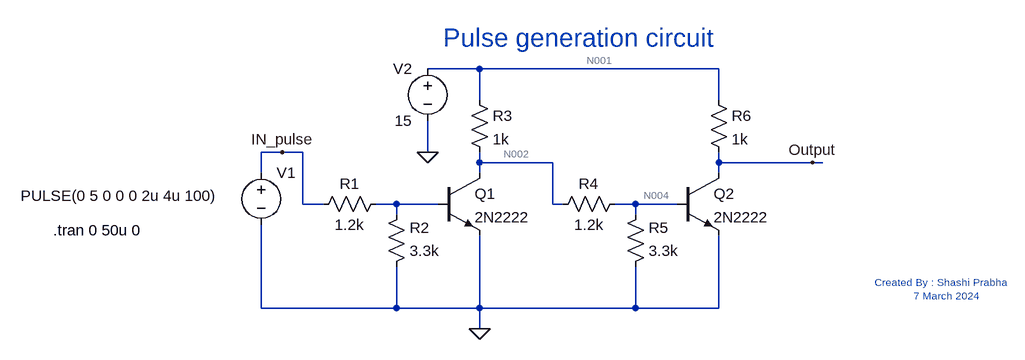
[diagram p0: schematic Pulse generation circuit.asc]
Pulse generation circuit.asc, the LTspice schematic file:
Version 4
SHEET 1 1060 680
WIRE 240 -32 160 -32
WIRE 608 -32 240 -32
WIRE 240 16 240 -32
WIRE 608 16 608 -32
WIRE -64 96 -96 96
WIRE -32 96 -64 96
WIRE 160 96 160 48
WIRE 240 112 240 96
WIRE 352 112 240 112
WIRE 608 112 608 96
WIRE 752 112 608 112
WIRE 768 112 752 112
WIRE -96 128 -96 96
WIRE 240 128 240 112
WIRE 608 128 608 112
WIRE -32 176 -32 96
WIRE 0 176 -32 176
WIRE 112 176 80 176
WIRE 176 176 112 176
WIRE 352 176 352 112
WIRE 368 176 352 176
WIRE 480 176 448 176
WIRE 544 176 480 176
WIRE 112 192 112 176
WIRE 480 192 480 176
WIRE -96 336 -96 208
WIRE 112 336 112 272
WIRE 112 336 -96 336
WIRE 240 336 240 224
WIRE 240 336 112 336
WIRE 480 336 480 272
WIRE 480 336 240 336
WIRE 608 336 608 224
WIRE 608 336 480 336
WIRE 240 368 240 336
FLAG 752 112 Output
FLAG -64 96 IN_pulse
FLAG 240 368 0
FLAG 160 96 0
SYMBOL res 96 160 R90
WINDOW 0 0 56 VBottom 2
WINDOW 3 32 56 VTop 2
SYMATTR InstName R1
SYMATTR Value 1.2k
SYMBOL res 96 288 M180
WINDOW 0 36 76 Left 2
WINDOW 3 36 40 Left 2
SYMATTR InstName R2
SYMATTR Value 3.3k
SYMBOL npn 176 128 R0
SYMATTR InstName Q1
SYMATTR Value 2N2222
SYMBOL res 224 0 R0
SYMATTR InstName R3
SYMATTR Value 1k
SYMBOL res 464 160 R90
WINDOW 0 0 56 VBottom 2
WINDOW 3 32 56 VTop 2
SYMATTR InstName R4
SYMATTR Value 1.2k
SYMBOL res 464 288 M180
WINDOW 0 36 76 Left 2
WINDOW 3 36 40 Left 2
SYMATTR InstName R5
SYMATTR Value 3.3k
SYMBOL npn 544 128 R0
SYMATTR InstName Q2
SYMATTR Value 2N2222
SYMBOL res 592 0 R0
SYMATTR InstName R6
SYMATTR Value 1k
SYMBOL voltage -96 112 R0
WINDOW 3 -370 51 Left 2
WINDOW 123 0 0 Left 0
WINDOW 39 0 0 Left 0
SYMATTR InstName V1
SYMATTR Value PULSE(0 5 0 0 0 2u 4u 100)
SYMBOL voltage 160 -48 M0
WINDOW 123 0 0 Left 0
WINDOW 39 0 0 Left 0
SYMATTR InstName V2
SYMATTR Value 15
TEXT -416 216 Left 2 !.tran 0 50u 0
TEXT 184 -80 Left 4 ;Pulse generation circuit
TEXT 848 296 Left 1 ;Created By : Shashi Prabha\n             7 March 2024

The netlist it stands for:
* Pulse generation circuit.asc
R1 N003 IN_pulse 1.2k
R2 0 N003 3.3k
Q1 N002 N003 0 0 2N2222
R3 N001 N002 1k
R4 N004 N002 1.2k
R5 0 N004 3.3k
Q2 Output N004 0 0 2N2222
R6 N001 Output 1k
V1 IN_pulse 0 PULSE(0 5 0 0 0 2u 4u 100)
V2 N001 0 15
.model NPN NPN
.model PNP PNP
.lib standard.bjt
.tran 0 50u 0
* Pulse generation circuit
* Created By : Shashi Prabha
*              7 March 2024
.backanno
.end

* Results of the author's LTspice run, read from the files saved beside the schematic
* Operating Point, zero values left out:
*   V(n002) = 8.554 V
*   V(n001) = 15 V
*   V(n004) = 817.8 mV
*   V(output) = 30.49 mV
*   Ic(Q1) = 8.574 pA
*   Ib(Q1) = -8.557 pA
*   Ic(Q2) = 14.97 mA
*   Ib(Q2) = 6.199 mA
*   Ie(Q2) = -21.17 mA
*   I(R1) = 6.275 pA
*   I(R2) = -2.282 pA
*   I(R3) = 6.446 mA
*   I(R4) = -6.446 mA
*   I(R5) = -247.8 µA
*   I(R6) = 14.97 mA
*   I(V1) = 6.275 pA
*   I(V2) = -21.42 mA
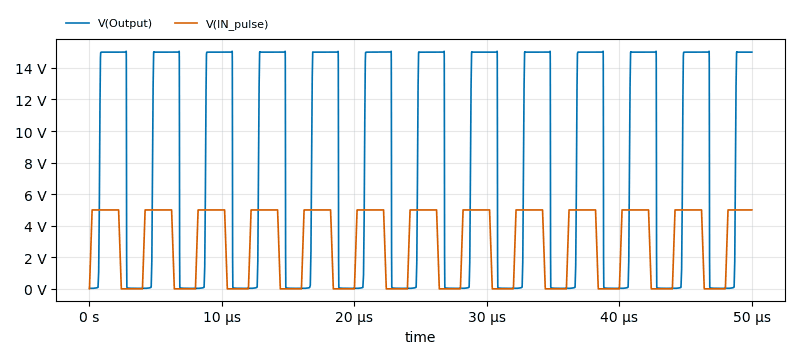
[diagram p1: Transient Analysis of Pulse generation circuit.asc, plotted from the saved traces]
* Transient Analysis, 1 run:
*   V(Output): min 24.89 mV, max 15.06 V, average 7.727 V, rms 10.68 V, last 15 V
*   V(IN_pulse): min 0 V, max 5 V, average 2.83 V, rms 3.707 V, last 5 V